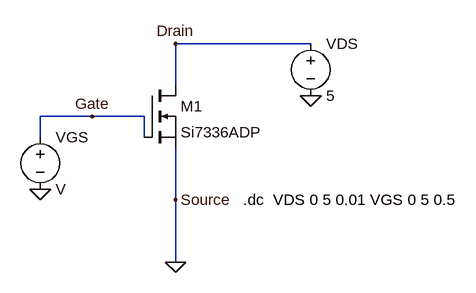
[diagram p0: schematic MOSFET_Drain_Characteristics.asc]
MOSFET_Drain_Characteristics.asc, the LTspice schematic file:
Version 4
SHEET 1 880 680
WIRE 432 48 224 48
WIRE 224 112 224 48
WIRE 96 160 16 160
WIRE 176 160 96 160
WIRE 16 192 16 160
WIRE 176 192 176 160
WIRE 224 288 224 208
WIRE 224 384 224 288
FLAG 432 128 0
FLAG 16 272 0
FLAG 224 384 0
FLAG 224 48 Drain
FLAG 96 160 Gate
FLAG 224 288 Source
SYMBOL voltage 16 176 R0
SYMATTR InstName VGS
SYMBOL voltage 432 32 R0
WINDOW 123 0 0 Left 0
WINDOW 39 0 0 Left 0
SYMATTR InstName VDS
SYMATTR Value 5
SYMBOL nmos 176 112 R0
SYMATTR InstName M1
SYMATTR Value Si7336ADP
TEXT 328 288 Left 2 !.dc  VDS 0 5 0.01 VGS 0 5 0.5

The netlist it stands for:
* MOSFET_Drain_Characteristics.asc
VGS Gate 0 V
VDS Drain 0 5
M1 Drain Gate 0 0 Si7336ADP
.model NMOS NMOS
.model PMOS PMOS
.lib standard.mos
.dc  VDS 0 5 0.01 VGS 0 5 0.5
.backanno
.end